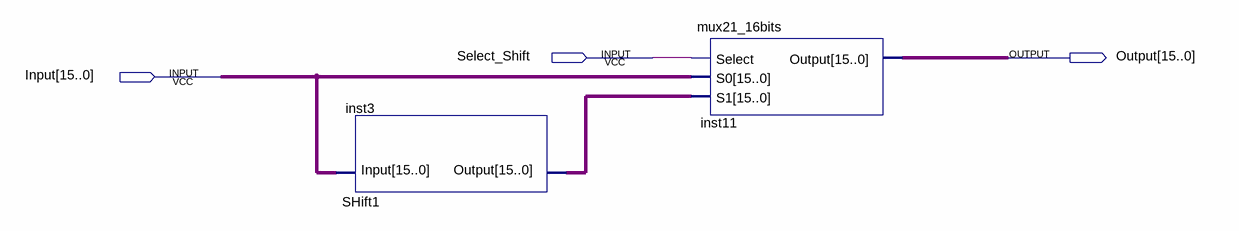
[diagram p0: schematic sheet]
// Quartus schematic Shift_Design.bdf as structural Verilog: 2 symbols, 3 pins
module Shift_Design (
  input  Select_Shift,
  input  [15:0] Input,
  output [15:0] Output
);

  wire [15:0] inst3_output;

  SHift1 inst3 (.Input(Input), .Output(inst3_output));
  mux21_16bits inst11 (.Select(Select_Shift), .S0(Input), .S1(inst3_output), .Output(Output));
endmodule
